# EAGLE design SeguidorC1.0 (EAGLE 9.5.1)
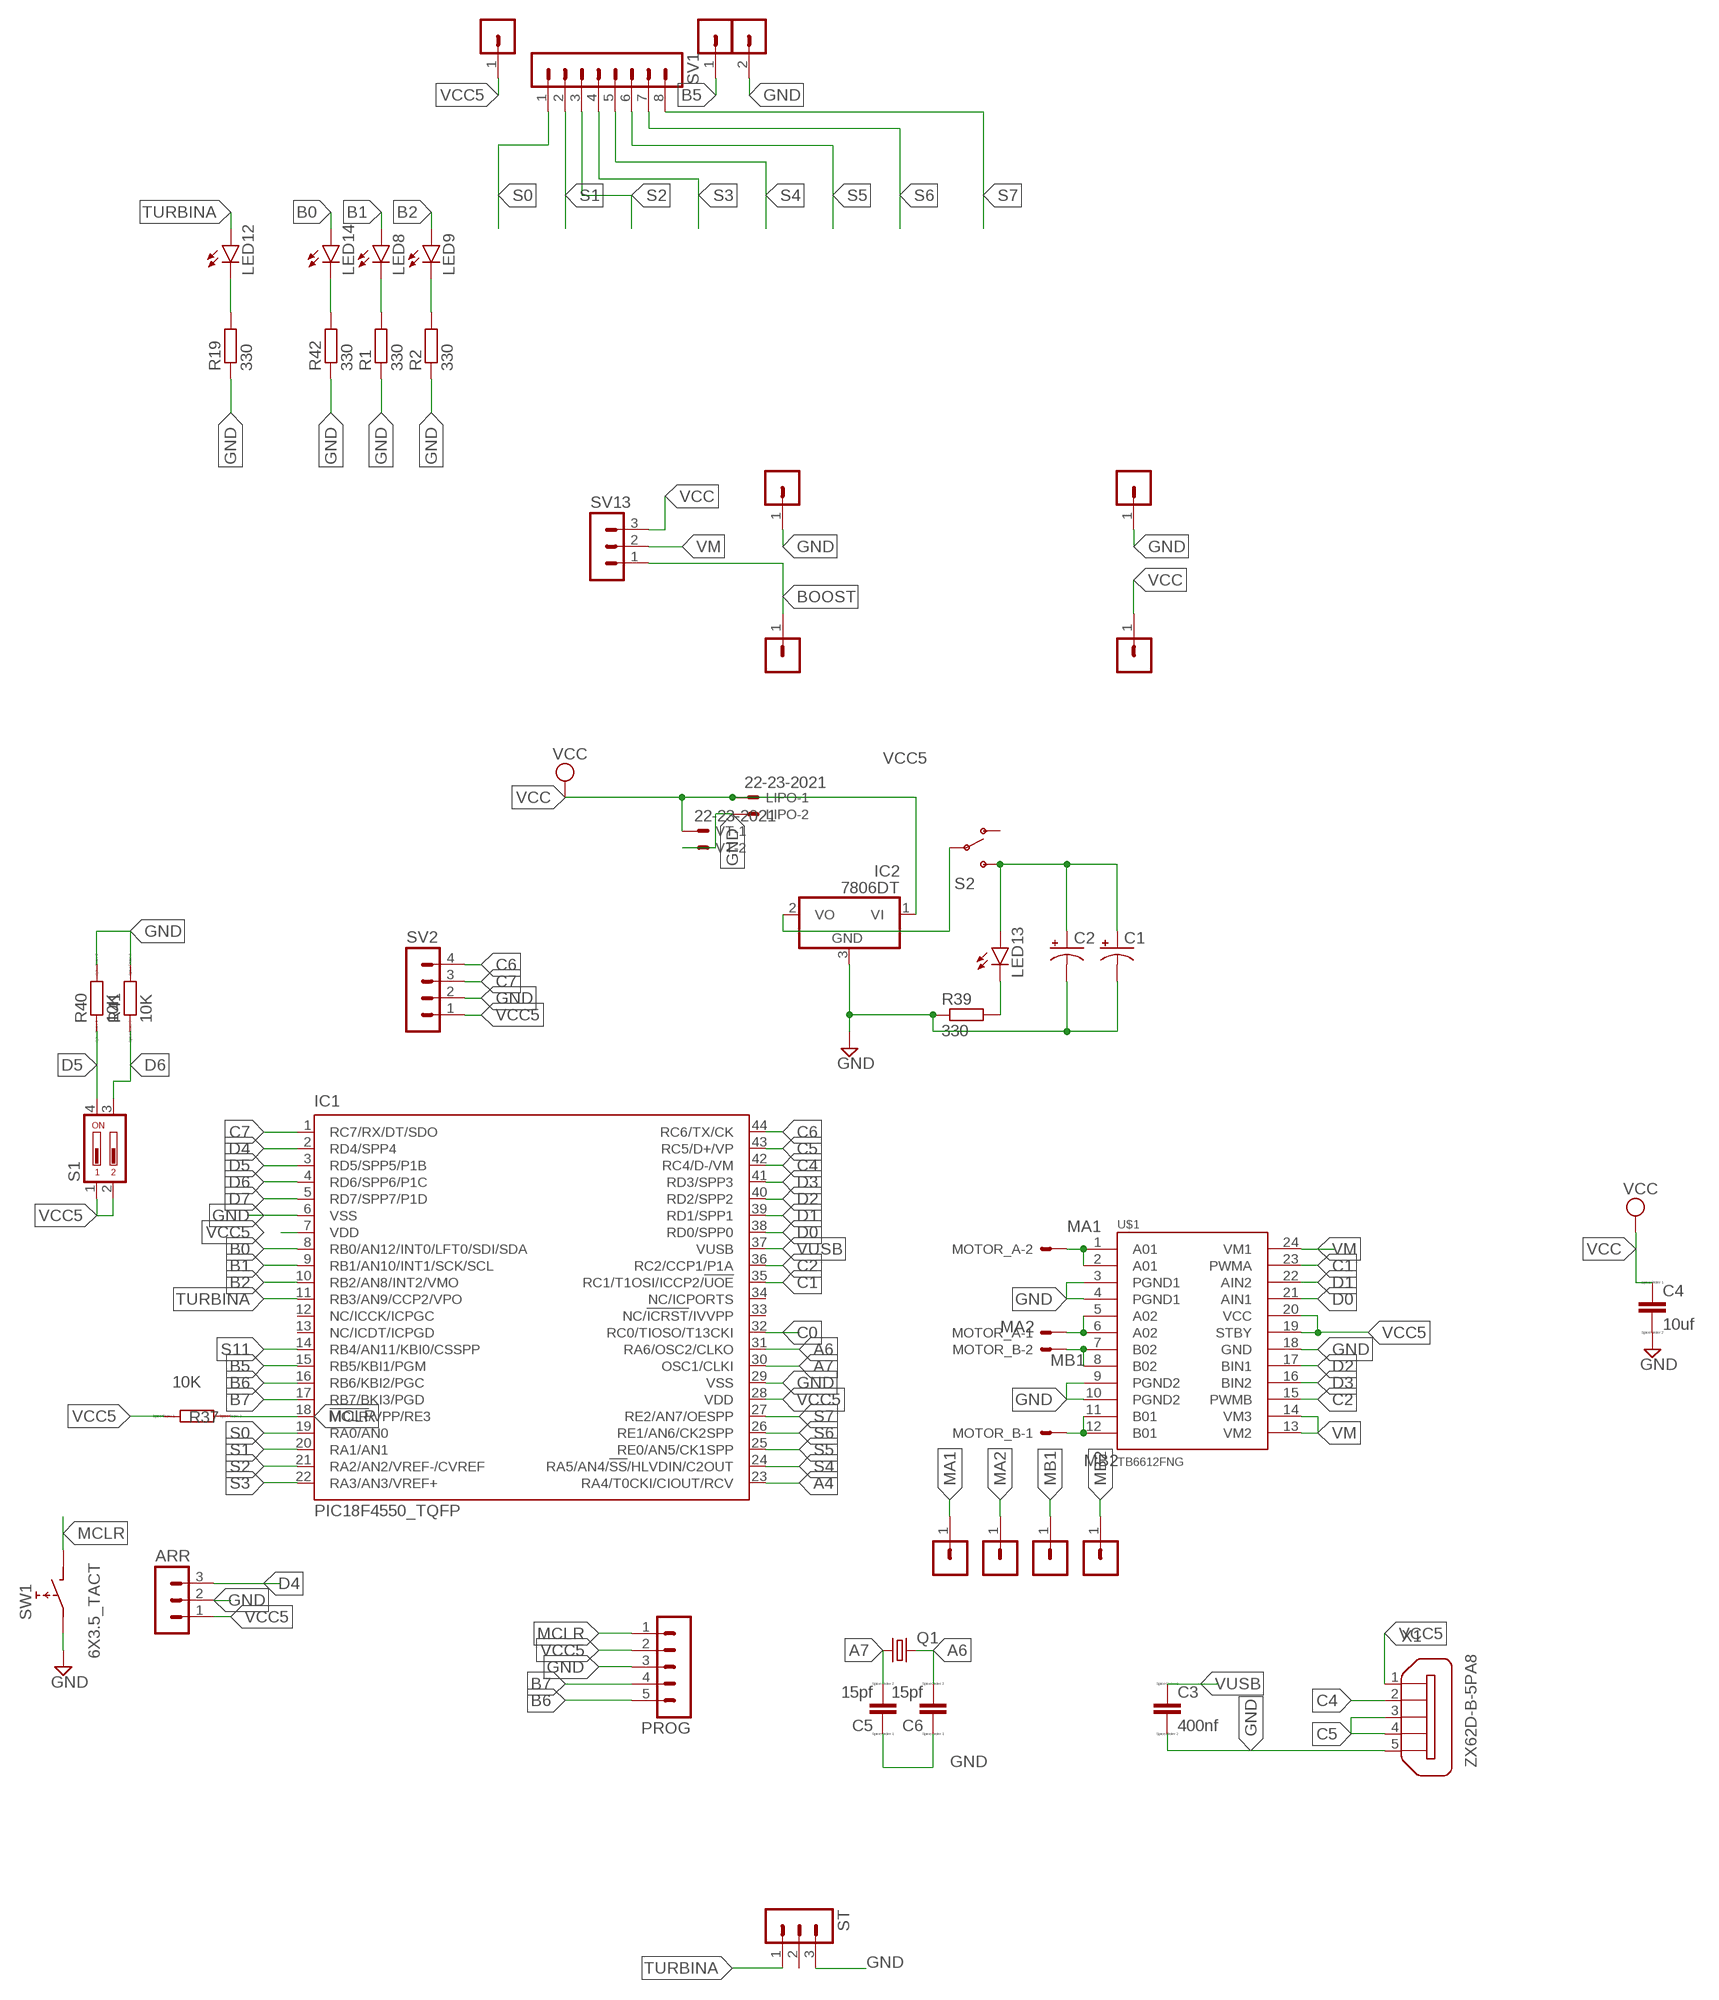
[diagram p0: schematic, sheet 1]

## Parts
ARR  MA03-1  [MA03-1]
C1  CPOL-US153CLV-0505  [153CLV-0505]
C2  CPOL-US153CLV-0505  [153CLV-0505]
C3  400nf  C  [C0805]
C4  10uf  C  [C0805]
C5  15pf  C  [C0805]
C6  15pf  C  [C0805]
IC1  PIC18F4550_TQFP  [TQFP44]
IC2  7806DT  [TO252]
LED8  LEDCHIP-LED0805  [CHIP-LED0805]
LED9  LEDCHIP-LED0805  [CHIP-LED0805]
LED12  LEDCHIP-LED0805  [CHIP-LED0805]
LED13  LEDCHIP-LED0805  [CHIP-LED0805]
LED14  LEDCHIP-LED0805  [CHIP-LED0805]
LIPO  22-23-2021  [22-23-2021]
MOTOR_A  22-23-2021  [22-23-2021]
MOTOR_B  22-23-2021  [22-23-2021]
PROG  MA05-1  [MA05-1]
Q1  CRYSTALHC49U-V  [HC49U-V]
R1  330  R-EU_R0805  [R0805]
R2  330  R-EU_R0805  [R0805]
R19  330  R-EU_R0805  [R0805]
R37  10K  R  [R0805]
R39  330  R-EU_R0805  [R0805]
R40  10K  R  [R0805]
R41  10K  R  [R0805]
R42  330  R-EU_R0805  [R0805]
S1  DIP02YL  [DIP02YL]
S2  SWITCH-SPSTPTH  [SWITCH-SPDT]
ST  MA03-1  [MA03-1]
SV1  MA08-1  [MA08-1]
SV2  MA04-1  [MA04-1]
SV3  MA01-1  [MA01-1]
SV4  MA01-1  [MA01-1]
SV5  MA01-1  [MA01-1]
SV6  MA01-1  [MA01-1]
SV7  MA01-1  [MA01-1]
SV8  MA02-1  [MA02-1]
SV9  MA01-1  [MA01-1]
SV10  MA01-1  [MA01-1]
SV11  MA01-1  [MA01-1]
SV12  MA01-1  [MA01-1]
SV13  MA03-1  [MA03-1]
SW1  6X3.5_TACT  [TACT_6X3.5]
U$1  TB6612FNG  [SSOP24]
VT  22-23-2021  [22-23-2021]
X1  ZX62D-B-5PA8  [ZX62D-B-5PA8]

## Nets
A4: IC1.23(RA4/T0CKI/CIOUT/RCV)
A6: C6.2 IC1.31(RA6/OSC2/CLKO) Q1.2
A7: C5.2 IC1.30(OSC1/CLKI) Q1.1
B0: IC1.8(RB0/AN12/INT0/LFT0/SDI/SDA) LED14.A
B1: IC1.9(RB1/AN10/INT1/SCK/SCL) LED8.A
B2: IC1.10(RB2/AN8/INT2/VMO) LED9.A
B5: IC1.15(RB5/KBI1/PGM) SV8.1
B6: IC1.16(RB6/KBI2/PGC) PROG.5
B7: IC1.17(RB7/BKI3/PGD) PROG.4
BOOST: SV11.1 SV13.1
C0: IC1.32(RC0/TIOSO/T13CKI)
C1: IC1.35(RC1/T1OSI/ICCP2/!UOE) U$1.23(PWMA)
C2: IC1.36(RC2/CCP1/P1A) U$1.15(PWMB)
C4: IC1.42(RC4/D-/VM) X1.2
C5: IC1.43(RC5/D+/VP) X1.3 X1.4
C6: IC1.44(RC6/TX/CK) SV2.4
C7: IC1.1(RC7/RX/DT/SDO) SV2.3
D0: IC1.38(RD0/SPP0) U$1.21(AIN1)
D1: IC1.39(RD1/SPP1) U$1.22(AIN2)
D2: IC1.40(RD2/SPP2) U$1.17(BIN1)
D3: IC1.41(RD3/SPP3) U$1.16(BIN2)
D4: ARR.3 IC1.2(RD4/SPP4)
D5: IC1.3(RD5/SPP5/P1B) R40.1 S1.4
D6: IC1.4(RD6/SPP6/P1C) R41.1 S1.3
D7: IC1.5(RD7/SPP7/P1D)
GND: ARR.2 C1.- C2.- C3.2 C4.2 C5.1 C6.1 IC1.6(VSS) IC1.29(VSS) IC2.3(GND) LIPO.2 PROG.3 R1.1 R2.1 R19.1 R39.1 R40.2 R41.2 R42.1 ST.3 SV2.2 SV8.2 SV9.1 SV10.1 SW1.P$1 U$1.3(PGND1) U$1.4(PGND1) U$1.9(PGND2) U$1.10(PGND2) U$1.18(GND) VT.2 X1.5
MA1: MOTOR_A.2 SV3.1 U$1.1(A01) U$1.2(A01)
MA2: MOTOR_A.1 SV4.1 U$1.5(A02) U$1.6(A02)
MB1: MOTOR_B.2 SV5.1 U$1.7(B02) U$1.8(B02)
MB2: MOTOR_B.1 SV6.1 U$1.11(B01) U$1.12(B01)
MCLR: IC1.18(!MCLR!/VPP/RE3) PROG.1 R37.2 SW1.P$2
N$1: IC2.2(VO) S2.2(P)
N$2: LED8.C R1.2
N$3: LED9.C R2.2
N$16: LED12.C R19.2
N$25: LED13.C R39.2
N$33: LED14.C R42.2
S0: IC1.19(RA0/AN0) SV1.1
S1: IC1.20(RA1/AN1) SV1.2
S2: IC1.21(RA2/AN2/VREF-/CVREF) SV1.3
S3: IC1.22(RA3/AN3/VREF+) SV1.4
S4: IC1.24(RA5/AN4/!SS!/HLVDIN/C2OUT) SV1.5
S5: IC1.25(RE0/AN5/CK1SPP) SV1.6
S6: IC1.26(RE1/AN6/CK2SPP) SV1.7
S7: IC1.27(RE2/AN7/OESPP) SV1.8
S11: IC1.14(RB4/AN11/KBI0/CSSPP)
TURBINA: IC1.11(RB3/AN9/CCP2/VPO) LED12.A ST.1
VCC: C4.1 IC2.1(VI) LIPO.1 SV12.1 SV13.3 VT.1
VCC5: ARR.1 C1.+ C2.+ IC1.7(VDD) IC1.28(VDD) LED13.A PROG.2 R37.1 S1.1 S1.2 S2.3(S) SV2.1 SV7.1 U$1.19(STBY) U$1.20(VCC) X1.1
VM: SV13.2 U$1.13(VM2) U$1.14(VM3) U$1.24(VM1)
VUSB: C3.1 IC1.37(VUSB)
Unconnected: IC1.12(NC/ICCK/ICPGC) IC1.13(NC/ICDT/ICPGD) IC1.33(NC/!ICRST!/IVVPP) IC1.34(NC/ICPORTS) S2.1(O) ST.2 X1.S1 X1.S2 X1.S3 X1.S4

## Library data of the parts
ARR = con-lstb:MA03-1: PIN HEADER; OC_FARNELL: unknown; OC_NEWARK: unknown
C1 C2 = rcl_mod:CPOL-US: POLARIZED CAPACITOR, American symbol; SPICEPREFIX: C
C3-C6 = eagle-ltspice:C: CAPACITOR, European symbol; SPICEMODEL: NONE; SPICEPREFIX: C
IC1 = microchip:PIC18F4*_TQFP: USB Microcontrollers with nanoWatt Technology High-Performance, Enhanced Flash, 28/40/44-Pin, Source: http://ww1.microchip.com/downloads/en/devicedoc/39632c.pdf; MF: MICROCHIP; MPN: PIC18F4550-I/PT; OC_FARNELL: 9321365; OC_NEWARK: 08J9633
IC2 = regulador de voltaje linear:78*: Positive VOLTAGE REGULATOR Source: http://cache.national.com/ds/LM/LM78L05.pdf http://www.fairchildsemi.com/ds/LM/LM7805.pdf
LED8 LED9 LED12-LED14 = led:LED: LED OSRAM: - CHIPLED LG R971, LG N971, LY N971, LG Q971, LY Q971, LO R971, LY R971 LH N974, LH R974 LS Q976, LO Q976, LY Q976 LO Q996 - Hyper CHIPLED LW Q18S LB Q993, LB Q99A, LB R99A - SideLED LS A670, LO A670, LY A670, LG A670, LP A670 LB A673, LV A673, LT A673, LW A673 LH A674 LY A675 LS A676, LA A676, LO A676, LY A676, LW A676 LS A679, LY A679, LG A679 - Hyper Micro SIDELED® LS Y876, LA Y876, LO Y876, LY Y876 LT Y87S - SmartLED LW L88C, LW L88S LB L89C, LB L89S, LG L890 LS L89K, LO L89K, LY L89K LS L896, LA L896, LO L896, LY L896 - TOPLED LS T670, LO T670, LY T670, LG T670, LP T670 LSG T670, LSP T670, LSY T670, LOP T670, LYG T670 LG T671, LOG T671, LSG T671 LB T673, LV T673, LT T673, LW T673 LH T674 LS T676, LA T676, LO T676, LY T676, LB T676, LH T676, LSB T676, LW T676 LB T67C, LV T67C, LT T67C, LS T67K, LO T67K, LY T67K, LW E67C LS E67B, LA E67B, LO E67B, LY E67B, LB E67C, LV E67C, LT E67C LW T67C LS T679, LY T679, LG T679 LS T770, LO T770, LY T770, LG T770, LP T770 LB T773, LV T773, LT T773, LW T773 LH T774 LS E675, LA E675, LY E675, LS T675 LS T776, LA T776, LO T776, LY T776, LB T776 LHGB T686 LT T68C, LB T68C - Hyper Mini TOPLED® LB M676 - Mini TOPLED Santana® LG M470 LS M47K, LO M47K, LY M47K Source: http://www.osram.convergy.de LUXEON: - LUMILED® LXK2-PW12-R00, LXK2-PW12-S00, LXK2-PW14-U00, LXK2-PW14-V00 LXK2-PM12-R00, LXK2-PM12-S00, LXK2-PM14-U00 LXK2-PE12-Q00, LXK2-PE12-R00, LXK2-PE12-S00, LXK2-PE14-T00, LXK2-PE14-U00 LXK2-PB12-K00, LXK2-PB12-L00, LXK2-PB12-M00, LXK2-PB14-N00, LXK2-PB14-P00, LXK2-PB14-Q00 LXK2-PR12-L00, LXK2-PR12-M00, LXK2-PR14-Q00, LXK2-PR14-R00 LXK2-PD12-Q00, LXK2-PD12-R00, LXK2-PD12-S00 LXK2-PH12-R00, LXK2-PH12-S00 LXK2-PL12-P00, LXK2-PL12-Q00, LXK2-PL12-R00 Source: www.luxeon.com KINGBRIGHT: KA-3528ASYC Source: www.kingbright.com
LIPO MOTOR_A MOTOR_B VT = con-molex:22-23-2021: .100" (2.54mm) Center Header - 2 Pin; MF: MOLEX; MPN: 22-23-2021; OC_FARNELL: 1462926; OC_NEWARK: 25C3832
PROG = con-lstb:MA05-1: PIN HEADER
Q1 = crystal:CRYSTAL: CRYSTAL; OC_FARNELL: 1666969; OC_NEWARK: unknown
R1 R2 R19 R39 R42 = resistor:R-EU_: RESISTOR, European symbol
R37 R40 R41 = eagle-ltspice:R: RESISTOR, European symbol; SPICEMODEL: NONE; SPICEPREFIX: R
S1 = switch-dil:DIP02YL: DIL/CODE SWITCH; OC_FARNELL: unknown; OC_NEWARK: unknown
S2 = SparkFun:SWITCH-SPST: SPST Switch Simple slide switch. Spark Fun Electronics SKU : COM-00102
ST SV13 = con-lstb:MA03-1: PIN HEADER
SV1 = con-lstb:MA08-1: PIN HEADER
SV2 = con-lstb:MA04-1: PIN HEADER
SV3-SV7 SV9-SV12 = con-lstb:MA01-1: PIN HEADER
SV8 = con-lstb:MA02-1: PIN HEADER
SW1 = tactile_switch:6X3.5_TACT
U$1 = SparkFun-IC-Special-Function:TB6612FNG: Toshiba 1A dual motor driver IC-09363; PROD_ID: IC-09363
X1 = micro_USB:ZX62D-B-5PA8: Micro USB Type B Connector - Standard, Shell Through Hole Source: http://www.hirose.co.jp/cataloge_hp/ed_ZX_20140804.pdf; MF: Hirose; MPN: ZX62D-B-5PA8; OC_FARNELL: 2300438; OC_NEWARK: 69W0712

## Board
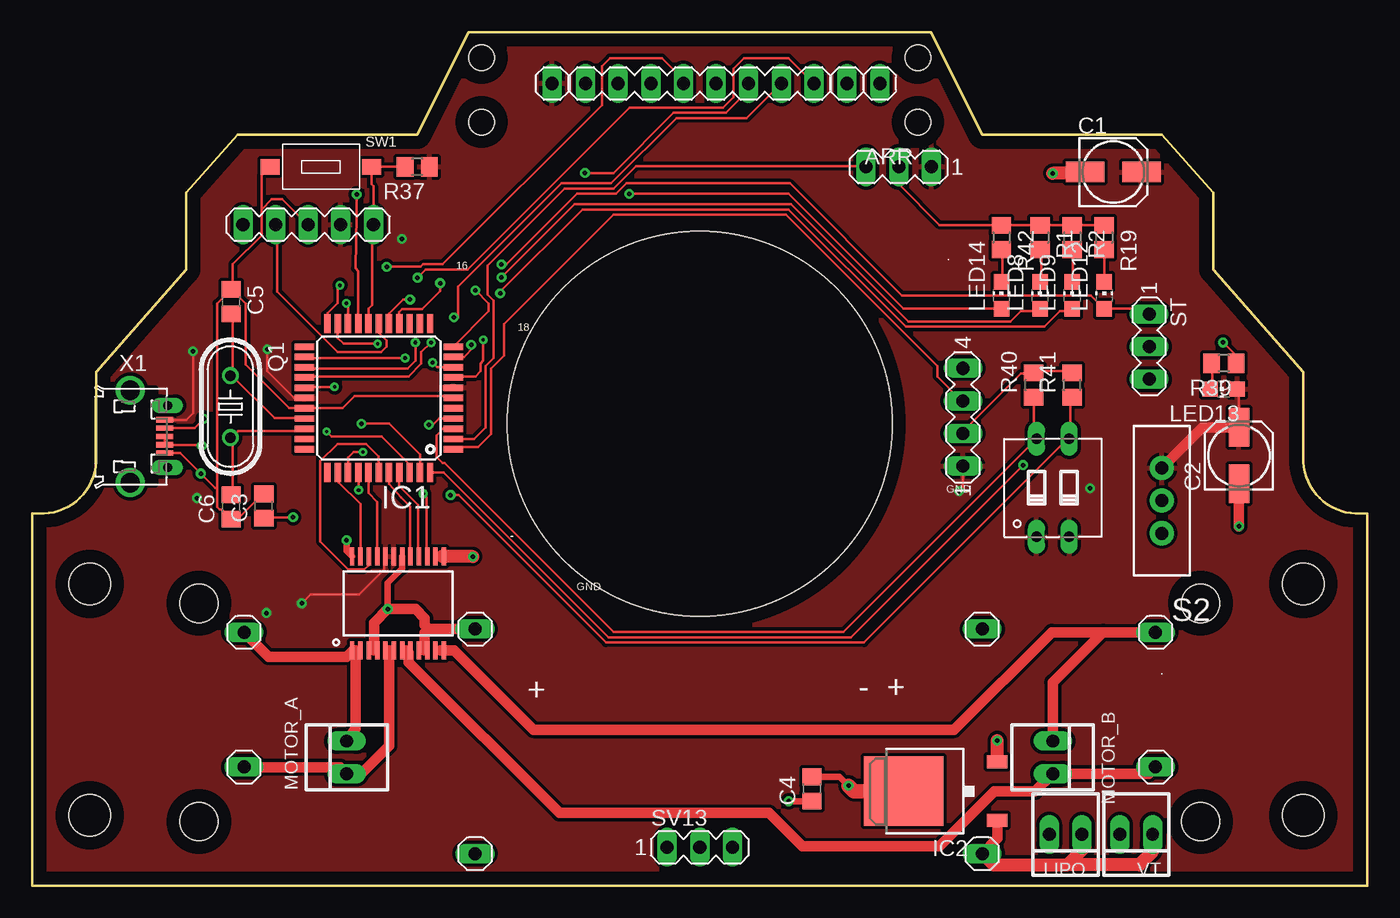
[diagram p1: board, top side]
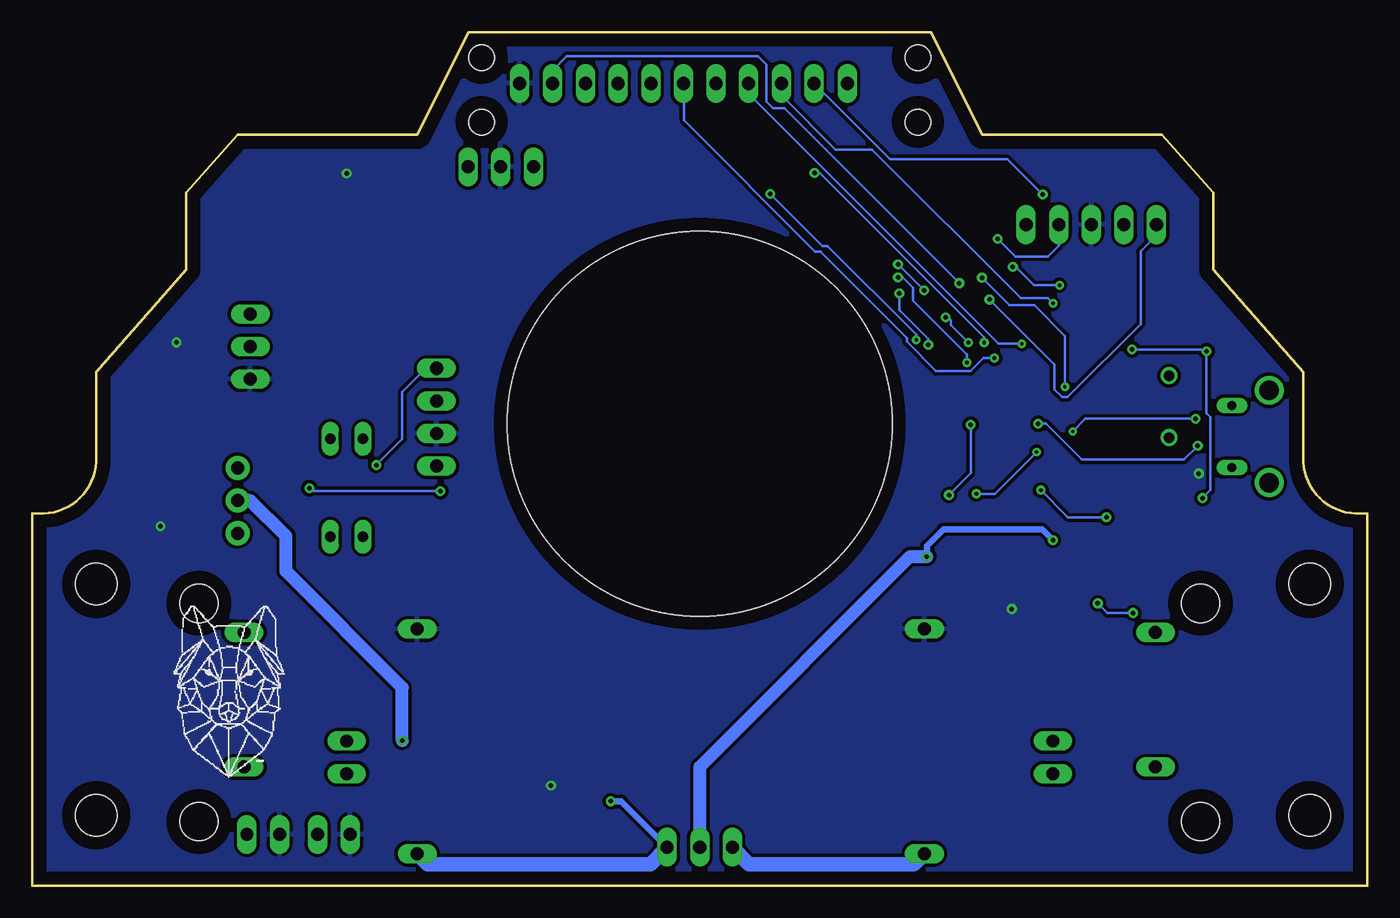
[diagram p2: board, bottom side, seen from below]

Size 104 x 66.5 mm. Coordinates in mm from the lower left corner, seen from the top.
Outline: 0,0 104,0 104,29 103.5,29 arc-90 99,33 99,40 92,48 92,54 88,58.5 74,58.5 70,66.5 34,66.5 30,58.5 16,58.5 12,54 12,48 5,40 5,33 arc-90 0.5,29 0,29 0,0
Copper layers (1*16): Top 0.035mm / dielectric 1.5mm / Bottom 0.035mm
Design rules "default *": minimum track width 8mil, minimum drill 0.25mm, track to track 8mil, track to pad 8mil, pad to pad 8mil, via to via 8mil, smd to smd 8mil, copper to edge 40mil, drill to drill 8mil, minimum pad ring 10mil, minimum via ring 8mil, stop-mask expansion 4mil, vias tented up to drill 0mil, thermal gap 10mil
Holes 30 mm at 52,36
Holes 2 mm at 35,64.5 35,59.5 69,64.5 69,59.5
Holes 3.25 mm at 4.5,23.5 4.5,5.5 99,23.5 99,5.5
Holes 3 mm at 13,5 13,22 91,22 91,5

### Footprints (pad centres in the part's own frame; a part is rotated, then mirrored left to right if it is on the bottom)
MA03-1 = drill 1.016 long: 1 -2.54,0; 2 0,0; 3 2.54,0
153CLV-0505 = smd 3 x 1.6: + 2.2,0; - -2.2,0
C0805 = smd 1.3 x 1.5: 1 -0.95,0; 2 0.95,0
TQFP44 = smd 1.5 x 0.5: 1 -5.8,4; 2 -5.8,3.2; 3 -5.8,2.4; 4 -5.8,1.6; 5 -5.8,0.8; 6 -5.8,0; 7 -5.8,-0.8; 8 -5.8,-1.6; 9 -5.8,-2.4; 10 -5.8,-3.2; 11 -5.8,-4; 23 5.8,-4; 24 5.8,-3.2; 25 5.8,-2.4; 26 5.8,-1.6; 27 5.8,-0.8; 28 5.8,0; 29 5.8,0.8; 30 5.8,1.6; 31 5.8,2.4; 32 5.8,3.2; 33 5.8,4 | smd 0.5 x 1.5: 12 -4,-5.8; 13 -3.2,-5.8; 14 -2.4,-5.8; 15 -1.6,-5.8; 16 -0.8,-5.8; 17 0,-5.8; 18 0.8,-5.8; 19 1.6,-5.8; 20 2.4,-5.8; 21 3.2,-5.8; 22 4,-5.8; 34 4,5.8; 35 3.2,5.8; 36 2.4,5.8; 37 1.6,5.8; 38 0.8,5.8; 39 0,5.8; 40 -0.8,5.8; 41 -1.6,5.8; 42 -2.4,5.8; 43 -3.2,5.8; 44 -4,5.8
TO252 = smd 1 x 1.6: 1 -2.28,-4.8; 2 2.28,-4.8 | smd 5.4 x 6.2: 3 0,2.5
CHIP-LED0805 = smd 1.2 x 1.2: A 0,-1.05; C 0,1.05
22-23-2021 = drill 1 long: 1 -1.27,0; 2 1.27,0
MA05-1 = drill 1.016 long: 1 -5.08,0; 2 -2.54,0; 3 0,0; 4 2.54,0; 5 5.08,0
HC49U-V = drill 0.813: 1 -2.413,0; 2 2.413,0
R0805 = smd 1.3 x 1.5: 1 -0.95,0; 2 0.95,0
DIP02YL = drill 0.813 long: 1 -1.27,-3.81; 2 1.27,-3.81; 3 1.27,3.81; 4 -1.27,3.81
SWITCH-SPDT = drill 1.016 pad 1.88: 1 0,2.54; 2 0,0; 3 0,-2.54
MA08-1 = drill 1.016 long: 1 -8.89,0; 2 -6.35,0; 3 -3.81,0; 4 -1.27,0; 5 1.27,0; 6 3.81,0; 7 6.35,0; 8 8.89,0
MA04-1 = drill 1.016 long: 1 -3.81,0; 2 -1.27,0; 3 1.27,0; 4 3.81,0
MA01-1 = drill 1.016 long: 1 0,0
MA02-1 = drill 1.016 long: 1 -1.27,0; 2 1.27,0
TACT_6X3.5 = smd 1.5 x 1.2: P$1 -3.95,0; P$2 3.95,0
SSOP24 = smd 0.348 x 1.397: 1 -3.575,-3.656; 2 -2.925,-3.656; 3 -2.275,-3.656; 4 -1.625,-3.656; 5 -0.975,-3.656; 6 -0.325,-3.656; 7 0.325,-3.656; 8 0.975,-3.656; 9 1.625,-3.656; 10 2.275,-3.656; 11 2.925,-3.656; 12 3.575,-3.656; 13 3.575,3.656; 14 2.925,3.656; 15 2.275,3.656; 16 1.625,3.656; 17 0.975,3.656; 18 0.325,3.656; 19 -0.325,3.656; 20 -0.975,3.656; 21 -1.625,3.656; 22 -2.275,3.656; 23 -2.925,3.656; 24 -3.575,3.656
ZX62D-B-5PA8 = smd 1.35 x 0.4: 1 4.825,1.3; 2 4.825,0.65; 3 4.825,0; 4 4.825,-0.65; 5 4.825,-1.3 | drill 1.5: S1 2.15,-3.6; S2 2.15,3.6 | drill 0.7 long: S3 5.05,2.425; S4 5.05,-2.425

### Placement (x,y rotation side)
ARR  67.5,56 180 top
C1  84.2,55.6 0 top
C2  94,33.5 90 top
C3  18.05,29.58 90 top
C4  60.74,7.54 90 top
C5  15.5,45.5 270 top
C6  15.5,29.5 90 top
IC1  27,38 180 top
IC2  70.38,7.37 90 top
LED8  78.5,46 0 top
LED9  81,46 0 top
LED12  83.5,46 0 top
LED13  92.81,38.69 90 top
LED14  75.5,46 0 top
LIPO  80.5,4 180 top
MOTOR_A  24.5,10 90 top
MOTOR_B  79.5,10 270 top
PROG  21.5,51.5 180 top
Q1  15.45,37.32 270 top
R1  78.5,50.5 270 top
R2  81,50.5 270 top
R19  83.5,50.5 270 top
R37  30,56 180 top
R39  92.81,40.69 180 top
R40  78,39 90 top
R41  81,39 90 top
R42  75.5,50.5 270 top
S1  79.5,31 0 top
S2  88,30 180 top
ST  87,42 270 top
SV1  52,62.5 0 top
SV2  72.5,36.5 90 top
SV3  16.5,19.75 90 top
SV4  16.5,9.25 90 top
SV5  87.5,9.25 90 top
SV6  87.5,19.75 90 top
SV7  40.5,62.5 0 top
SV8  64.75,62.5 0 top
SV9  74,20 90 top
SV10  34.5,20 90 top
SV11  34.5,2.5 90 top
SV12  74,2.5 90 top
SV13  52,3 0 top
SW1  22.5,56 0 top
U$1  28.5,22 0 top
VT  86,4 180 top
X1  5.5,35 0 top

### Tracks (layer width: path | path; a pad name or v marks a point on that pad's centre or on a via)
A6
  Top 0.203: C6.2 15.63,30.54 15.63,34.8 Q1.2 15.63,35.01 16.03,35.41 21.13,35.41 IC1.31
A7
  Top 0.203: C5.2 15.63,44.35 15.63,39.88 Q1.1 15.63,39.68 18.88,36.43 21.13,36.43 IC1.30
B0  (via drill 0.25, 0.35)
  Top 0.203: v46.51,53.9 58.91,53.9 67.85,44.96 75.37,44.96 LED14.A | v35.13,42.52 35.13,40.9 34.93,40.7 34.93,40.09 34.52,39.68 32.91,39.68 IC1.8
  Bottom 0.203: v46.51,53.9 42.45,49.84 42.04,49.84 35.13,42.93 v35.13,42.52
B1  (via drill 0.3, 0.35)
  Top 0.203: v36.56,47.4 42.25,53.09 59.11,53.09 68.26,43.95 76.18,43.95 76.99,44.76 78.42,44.76 LED8.A | IC1.9 31.54,40.4 v31.2,40.75
  Bottom 0.203: v31.2,40.75 31.2,41.38 35.39,45.57 35.39,46.59 36.2,47.4 v36.56,47.4
B2  (via drill 0.35)
  Top 0.203: v36.45,46.16 36.45,46.28 42.86,52.69 58.91,52.69 68.05,43.54 78.82,43.54 80.04,44.76 80.85,44.76 LED9.A | v34.2,42.14 34.4,42.14 34.4,41.96 33.64,41.2 IC1.10
  Bottom 0.203: v36.45,46.16 36.45,44.86 34.2,42.6 v34.2,42.14
B5  (via drill 0.35)
  Top 0.203: IC1.15 28.6,44.68 28.84,44.91 30.36,44.91 31.78,46.34 v31.78,46.94
  Bottom 0.203: v31.78,46.94 45.4,60.56 46.31,60.56 46.82,61.07 46.82,63.96 47.48,64.62 62.36,64.62 63.48,63.51 SV8.1
B6  (via drill 0.35)
  Top 0.203: v29.43,45.67 28.9,45.67 27.8,44.56 IC1.16
  Bottom 0.203: v29.43,45.67 24.36,40.6 24.36,38.66 23.75,38.05 23.35,38.05 17.66,43.74 17.66,49.43 16.44,50.65 16.44,51.47 PROG.5
B7
  Top 0.203: PROG.4 19.08,51.38 19.08,46.29 23.8,41.56 27.18,41.56 27.62,42 27.62,42.47 27,43.09 IC1.17
BOOST
  Bottom 1.143: SV11.1 35.31,1.69 48.15,1.69 SV13.1
C1
  Top 0.203: U$1.23 25.58,25.66 25.58,29.72 23.88,31.43 23.88,32.12 IC1.35
C2  (via drill 0.25, 0.3)
  Top 0.203: v30.46,30.54 30.74,30.26 30.74,25.66 U$1.15 | v25.76,33.79 25.02,33.79 24.6,33.36 IC1.36
  Bottom 0.203: v30.46,30.54 29.01,30.54 v25.76,33.79
C4  (via drill 0.25, 0.35)
  Top 0.203: v22.94,35.39 23.32,35.01 27.23,35.01 29.4,32.83 IC1.42 | X1.2 12.66,35.65 v13.39,36.38
  Bottom 0.203: v22.94,35.39 21.95,36.38 v13.39,36.38
C5  (via drill 0.35)
  Top 0.203: X1.3 10.34,34.89 10.34,34.37 X1.4 13.13,34.35 v13.21,34.27 | IC1.43 30.2,33.61 27.81,36 v25.64,36
  Bottom 0.203: v25.64,36 25.02,36 22.23,33.2 14.28,33.2 v13.21,34.27
C6  (via drill 0.35)
  Top 0.203: v77.2,32.77 63.79,19.36 44.89,19.36 32.05,32.2 IC1.44
  Bottom 0.203: v77.2,32.77 75.16,34.8 75.16,38.46 73.34,40.29 72.52,40.29 SV2.4
C7
  Top 0.203: IC1.1 32.91,34.19 34.73,34.19 35.74,35.21 35.74,40.29 36.76,41.31 36.76,43.74 45.29,52.28 58.71,52.28 70.49,40.49 70.49,39.68 72.32,37.85 SV2.3
D0
  Top 0.203: IC1.38 26.2,30.59 26.88,29.91 U$1.21
D1
  Top 0.203: U$1.22 26.19,25.62 26.19,24.97 25.88,24.65 24.62,24.65 22.45,26.83 22.45,33.08 23.79,34.42 26.02,34.42 27,33.44 IC1.39
D2
  Top 0.203: IC1.40 27.8,31.29 28.76,30.25 28.76,30.23 29.45,29.55 29.45,25.69 U$1.17
D3
  Top 0.203: IC1.41 28.6,31.13 30.05,29.68 30.05,25.73 U$1.16
D4
  Top 0.203: ARR.3 64.9,56.06 47.04,56.06 45.29,54.31 41.48,54.31 35.47,48.29 35.47,46.05 35.95,45.57 35.95,41.1 35.34,40.49 35.34,35.71 34.43,34.8 IC1.2
D5
  Top 0.203: R40.1 78.01,37.85 78.01,35.21 78.21,35.01 S1.4 78.21,34.8 63.18,19.77 45.29,19.77 32.11,32.95 31.96,32.95 31.5,33.41 31.5,35.08 32.02,35.6 IC1.3
D6  (via drill 0.35)
  Top 0.203: IC1.4 31.7,36.4 31.21,35.91 v30.89,35.91 | v32.59,30.44 33.2,30.44 44.69,18.95 64.8,18.95 80.65,34.8 S1.3 80.85,35.01 80.85,37.85 R41.1
  Bottom 0.203: v30.89,35.91 30.89,32.14 v32.59,30.44
GND  (via drill 0.35)
  Top 0.203: 26.19,18.34 U$1.3 26.62,18.34 U$1.4 | 28.84,25.46 U$1.18 | 30.05,18.34 U$1.9 30.59,18.34 U$1.10 30.87,18.34 | 60.81,8.54 C4.2 60.61,8.34 | 21.33,37.24 IC1.29 | R19.1 83.5,51.47 81.06,51.47 R2.1 80.85,51.47 78.62,51.47 R1.1 78.42,51.47 75.57,51.47 R42.1 75.48,51.47 70.67,51.47 67.53,54.6 67.53,55.97 ARR.2 | C3.2 17.95,30.53 16.06,28.63 15.57,28.63 C6.1 15.42,28.71 14.81,29.32 14.61,29.32 14.41,29.52 14.41,30.99 | R41.2 80.85,40.09 78.01,40.09 R40.2 77.81,39.88 76.99,39.88 72.52,35.41 SV2.2 | 17.86,52.69 17.86,50.65 15.63,48.42 15.63,46.59 C5.1 | 17.86,52.69 18.67,53.5 19.49,53.5 21.32,51.67 PROG.3 | 14.41,30.99 14.41,45.37 15.42,46.39 C5.1 | IC1.29 20.04,37.2 16.64,40.59 16.64,45.37 15.63,46.39 C5.1 | X1.5 11.55,33.7 v13.14,32.11 14.26,30.99 14.41,30.99 | 17.86,52.69 17.86,55.31 SW1.P$1 | R39.1 93.76,41.33 v92.77,42.32 | IC1.29 24.17,37.2 25.1,38.13 32.67,38.13 IC1.6
  Top 0.508: U$1.18 28.82,24.71 27.69,23.58 v27.69,21.56 | C4.2 62.89,8.49 v63.58,7.8
  Top 0.813: C2.- v94,28 | SV10.1 30.9,20 | 30.9,20 30.59,19.69 30.59,18.34 | 26.62,18.34 26.62,20.49 v27.69,21.56 29.86,21.56 30.59,20.83 30.59,20.31 30.9,20
  Top 1.016: C1.- 81.9,55.5 v79.5,55.5
  Top 1.143: IC2.3 64.01,7.37 v63.58,7.8
  pour Bottom (isolate 0.254): -14.07,84.29 119.28,84.29 119.28,-11.12 -14.07,-11.12
MA1
  Top 0.203: U$1.2 25.2,18.34 25,18.34 U$1.1
  Top 0.813: 25,18.34 24.5,17.84 18.41,17.84 SV3.1 | MOTOR_A.2 25.2,12.27 25.2,18.34
MA2
  Top 0.203: U$1.6 27.8,18.34 U$1.5
  Top 0.813: SV4.1 16.52,9.23 24,9.23 MOTOR_A.1 25.64,8.73 27.8,10.89 27.8,18.34
MB1
  Top 0.203: U$1.8 29.14,18.34 U$1.7
  Top 0.813: SV5.1 86.98,8.73 MOTOR_B.2 78.12,7.35 74.94,7.35 70.67,3.08 60,3.08 57.41,5.67 41.06,5.67 29.34,17.39 29.34,18.14 29.14,18.34
MB2
  Top 0.203: U$1.12 31.81,18.34 U$1.11
  Top 0.813: 83.4,19.75 SV6.1 | 31.81,18.34 32.85,18.34 39.05,12.15 71.81,12.15 79.42,19.75 83.4,19.75 | MOTOR_B.1 79.5,15.85 83.4,19.75
MCLR
  Top 0.203: IC1.18 26.2,44.96 26.48,45.24 26.48,51.4 PROG.1 26.58,54.49 26.43,54.64 SW1.P$2 R37.2
N$1  (via drill 0.35)
  Top 1.016: IC2.2 75.18,11.3 v75.16,11.31
  Bottom 1.016: v75.16,11.31 75.16,15.42 84.23,24.49 84.23,27.23 87,30 S2.2
N$2
  Top 0.203: LED8.C 78.62,47.2 78.62,49.43 R1.2
N$3
  Top 0.203: LED9.C 81.06,47.2 81.06,49.43 R2.2
N$16
  Top 0.203: LED12.C 83.5,47.2 83.5,49.43 R19.2
N$25
  Top 0.203: LED13.C 91.9,38.82 91.9,40.64 R39.2
N$33
  Top 0.203: LED14.C 75.57,47.2 75.57,49.43 R42.2
S0  (via drill 0.35)
  Top 0.203: IC1.19 25.4,47.9 25.19,48.11 25.28,52.24 v25.28,53.85
  Bottom 0.203: v25.28,53.85 28.02,56.6 37.21,56.6 SV1.1
S1  (via drill 0.25)
  Top 0.203: v24.48,45.37 24.6,45.25 IC1.20
  Bottom 0.203: v24.48,45.37 24.88,45.77 27,45.77 38.58,57.35 41.42,57.35 45.5,61.42 45.5,62.44 SV1.2
S2  (via drill 0.25)
  Top 0.203: IC1.21 23.8,42.67 24.25,42.22 v26.91,42.22
  Bottom 0.203: v26.91,42.22 28.73,42.22 48.14,61.63 48.14,62.44 SV1.3
S3  (via drill 0.26, 0.35)
  Top 0.203: v23.98,46.78 23.78,46.58 23.78,45.38 23,44.6 IC1.22 | v27.62,48.21 30.26,48.21 30.46,48.42 31.98,48.42 44.38,60.82 44.38,63.86 44.99,64.47 49.05,64.47 50.73,62.79 SV1.4
  Bottom 0.203: v27.62,48.21 27.42,48.21 25.98,46.78 v23.98,46.78
S4  (via drill 0.3)
  Top 0.203: v29.04,41.1 21.33,41.1 IC1.24
  Bottom 0.203: v29.04,41.1 29.9,41.1 30.92,40.09 33.59,40.09 35.88,42.38 35.88,42.68 42.61,49.41 43.01,49.41 53.22,59.62 53.22,62.45 SV1.5
S5  (via drill 0.3, 0.35)
  Top 0.203: v29.85,42.32 29.85,40.9 29.24,40.29 21.33,40.29 IC1.25 | v43.06,55.53 45.29,55.53 49.97,60.2 54.03,60.2 55.66,61.83 55.66,62.44 SV1.6
  Bottom 0.203: v29.85,42.32 29.85,42.73 42.65,55.53 v43.06,55.53
S6  (via drill 0.3, 0.35)
  Top 0.203: v31.07,42.32 30.31,41.56 30.31,40.67 29.32,39.68 21.33,39.68 IC1.26 | v32.85,44.28 33.18,44.28 33.18,46.66 41.23,54.72 45.09,54.72 50.17,59.8 55.66,59.8 58.3,62.44 SV1.7
  Bottom 0.203: v32.85,44.28 32.7,44.28 32.44,44.02 32.44,43.69 v31.07,42.32
S7  (via drill 0.25, 0.35)
  Top 0.203: v23.55,38.87 21.33,38.87 IC1.27 | v30.02,47.37 30.66,48.01 33.91,48.01 46.51,60.61 53.83,60.61 54.64,61.42 54.64,63.66 55.45,64.47 58.91,64.47 60.74,62.64 SV1.8
  Bottom 0.203: v30.02,47.37 27.87,45.22 25.94,45.22 23.55,42.83 v23.55,38.87
TURBINA  (via drill 0.35)
  Top 0.203: v34.52,46.39 35.54,45.37 35.54,44.76 IC1.11 | v36.56,48.42 36.96,48.42 42.45,53.9 45.5,53.9 46.31,54.72 59.02,54.72 67.76,45.98 82.48,45.98 83.5,44.96 LED12.A 86.59,44.95 ST.1
  Bottom 0.203: v36.56,48.42 v34.52,46.39
VCC  (via drill 0.35)
  Top 0.508: C4.1 58.94,6.59 v58.93,6.58
  Top 0.813: SV12.1 75.18,3.68 IC2.1
  Top 1.016: SV12.1 74.88,1.62 80.62,1.62 | 80.62,1.62 82,3 82,3.77 LIPO.1 | VT.1 87.27,2.7 86.27,1.7 86.27,1.62 80.62,1.62
  Bottom 0.508: v58.93,6.58 58.12,6.58 SV13.3
  Bottom 1.143: SV13.3 55.85,1.69 73.19,1.69 SV12.1
VCC5  (via drill 0.35)
  Top 0.203: U$1.20 27.41,25.46 27.41,24.64 25.48,22.71 21.71,22.71 v21,22 | SV2.1 72.5,31.05 v72.19,30.74 | LED13.A 93.91,38.69 | 93.91,38.69 94.11,38.69 | IC1.28 20.43,38 18.33,40.1 18.33,40.11 18.32,40.11 v18.32,41.79 | v12.53,41.64 12.53,36.84 11.99,36.3 X1.1 | C2.+ 94,38.6 93.91,38.69
  Top 0.813: S2.3 91.16,35.7 C2.+
  Bottom 0.203: v21,22 20.25,21.25 v18.25,21.25 | v72.19,30.74 82.17,30.74 v82.4,30.97 | v18.32,41.79 12.68,41.79 v12.53,41.64 12.53,36.84 12.22,36.53 12.22,30.82 v12.83,30.21 | PROG.2 24.04,49.86 24.9,49 27.4,49 v28.8,50.4
  pour Top (isolate 0.254): 119.28,84 119.28,-12.39 -13.07,-12.39 -13.07,85.26
VM  (via drill 0.35)
  Top 0.203: U$1.13 32.09,25.66 31.96,25.66 31.48,25.66 U$1.14
  Top 0.508: U$1.24 24.49,26.09 v24.49,26.93
  Top 1.016: v34.32,25.63 31.98,25.63 31.96,25.66
  Bottom 0.508: v24.49,26.93 25.33,27.77 33.03,27.77 34.32,26.47 v34.32,25.63
  Bottom 1.016: SV13.2 52,9.25 35.62,25.63 v34.32,25.63
VUSB  (via drill 0.3, 0.35)
  Top 0.203: v20.33,28.71 18.15,28.71 C3.1 | v25.43,30.82 25.43,32.2 IC1.37
  Bottom 0.203: v20.33,28.71 23.32,28.71 v25.43,30.82

### Text on the board
tPlace: 16 | 18 | GND | GND | - | + | +
bPlace: -